# Altium project 边缘网关一体17KF4.PrjPcb
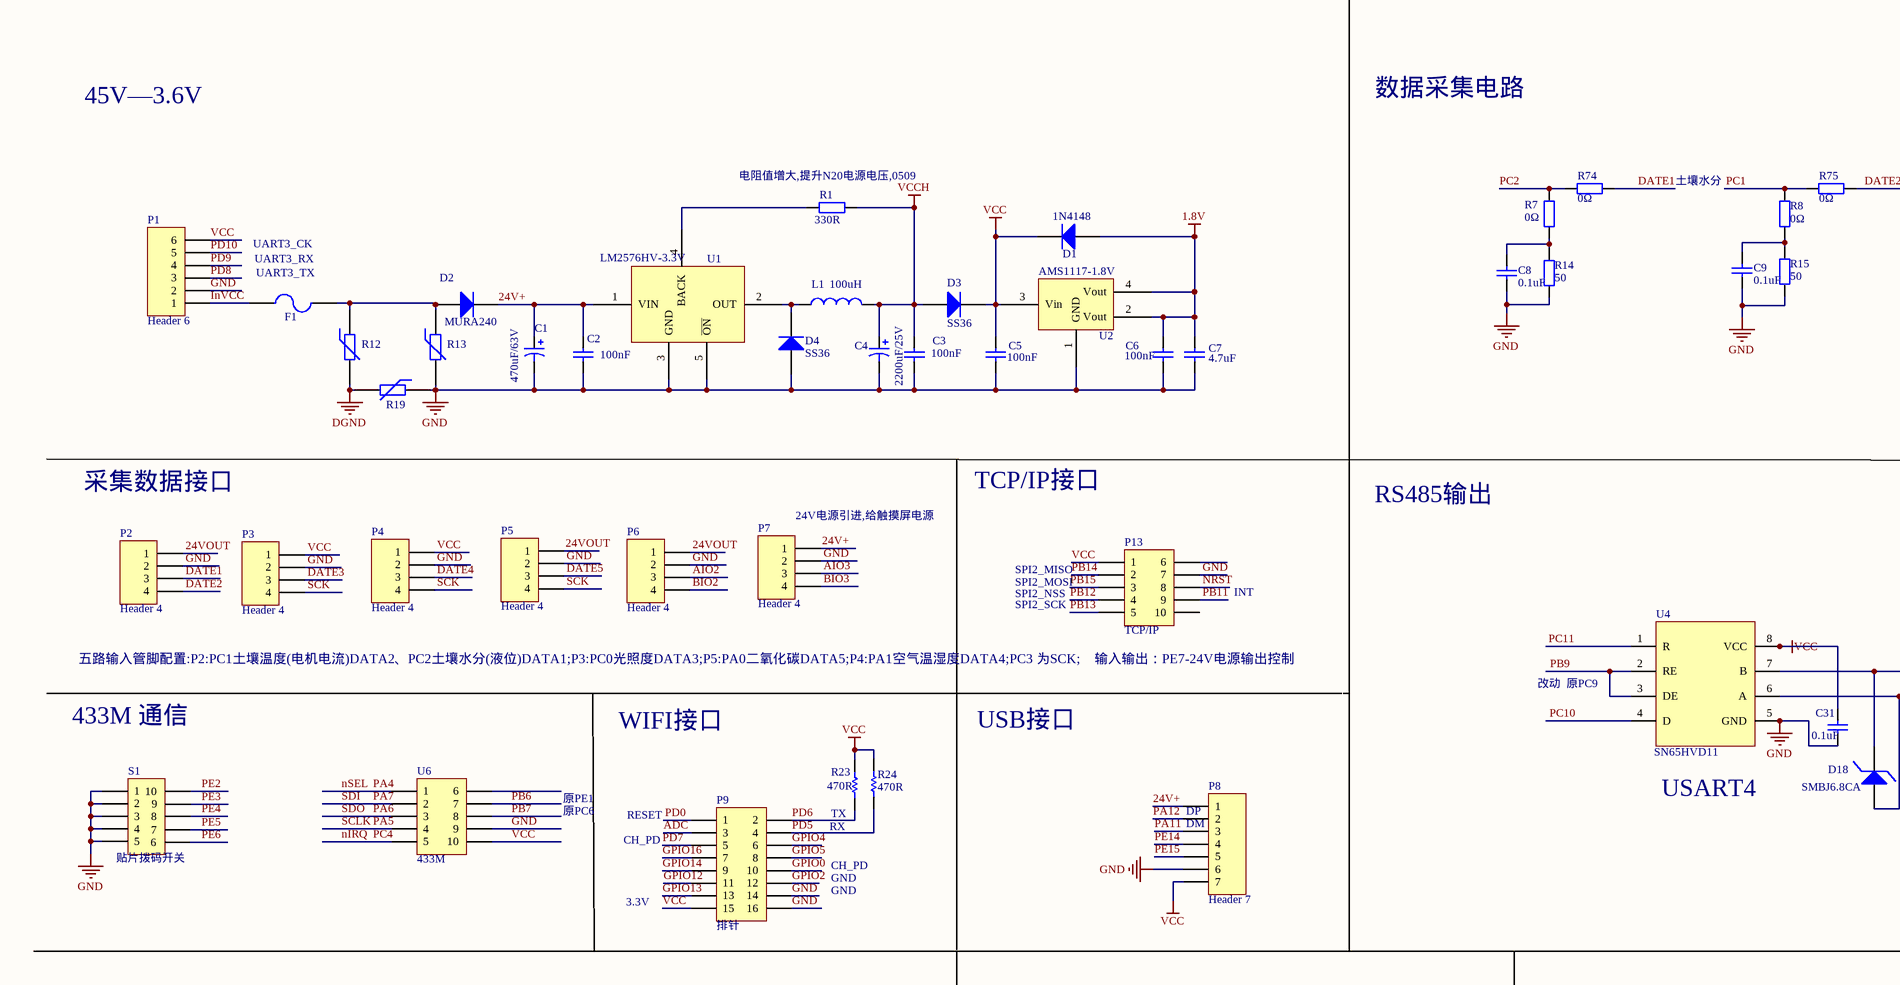
[diagram p0: 边缘网关一体.SchDoc, top left]
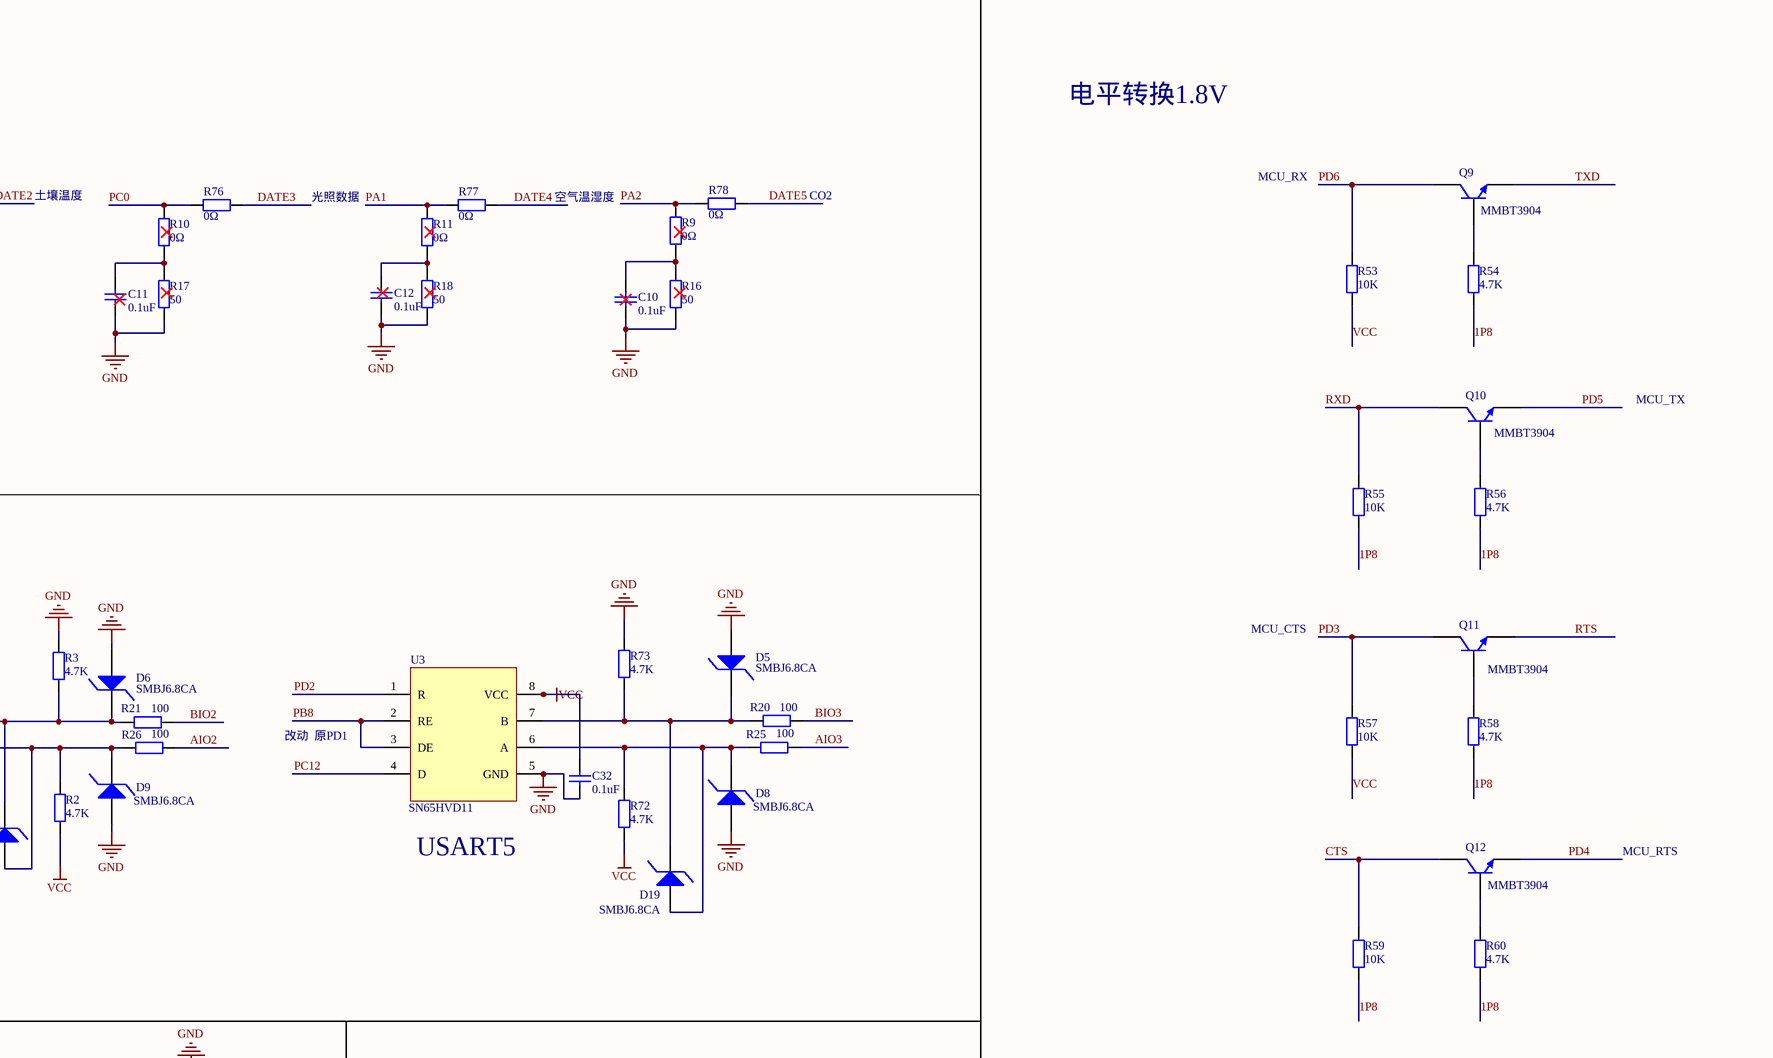
[diagram p1: 边缘网关一体.SchDoc, top right]
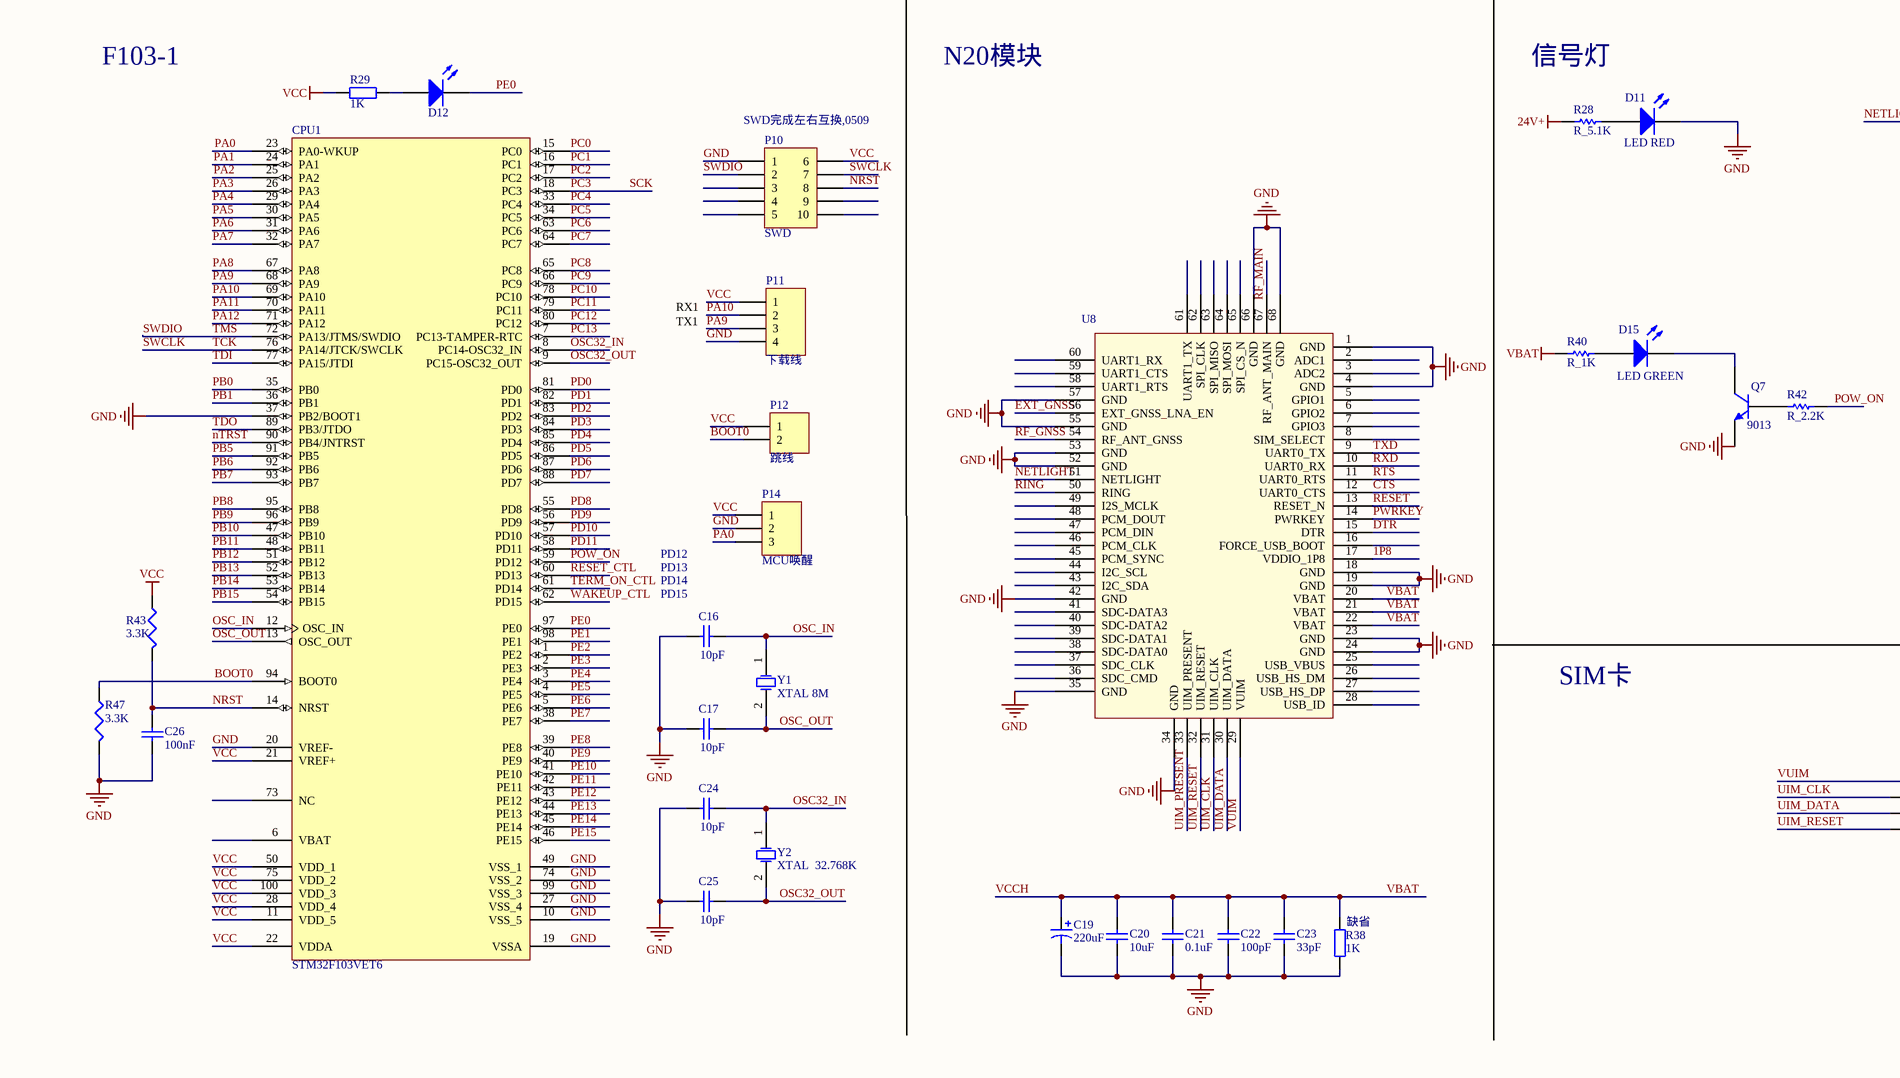
[diagram p2: 边缘网关一体.SchDoc, bottom left]
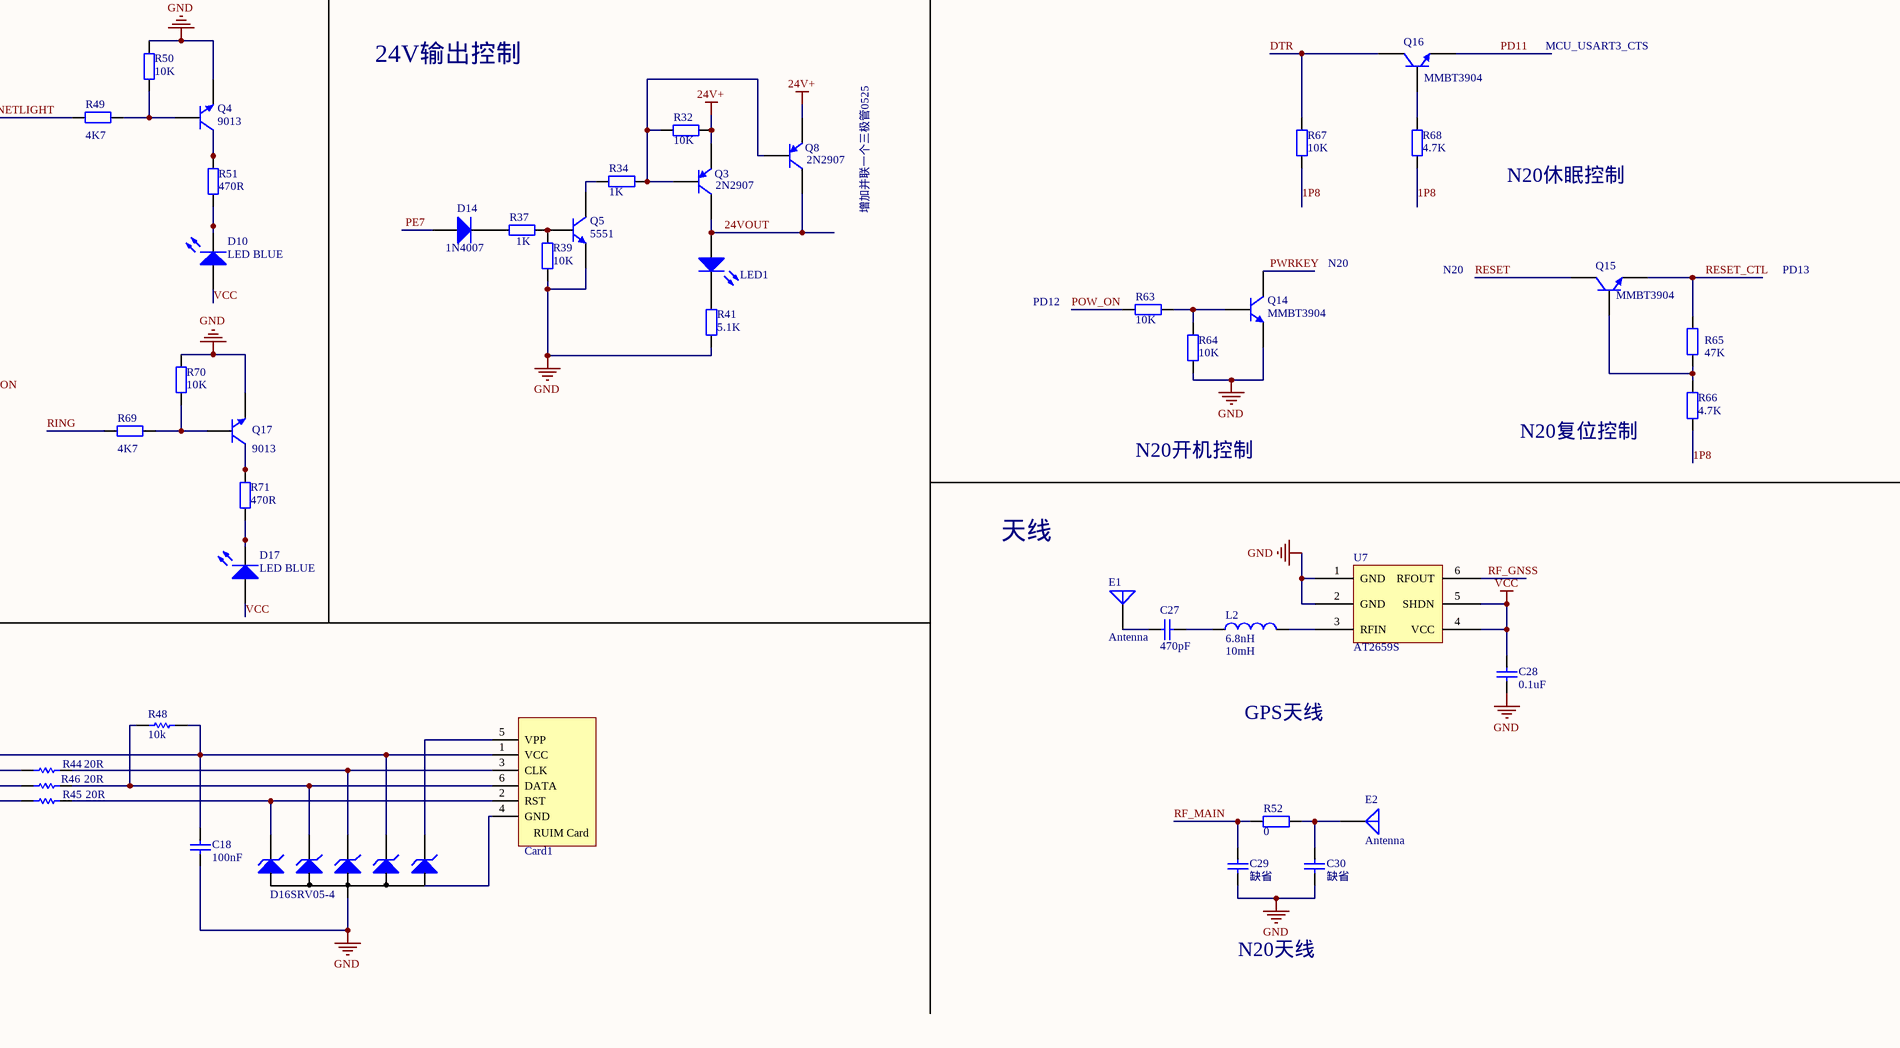
[diagram p3: 边缘网关一体.SchDoc, bottom right]
1 sheet, 157 parts. Net scope: global (net labels, ports and power ports of the same name join across sheets).
Board file: N20网关A.PcbDoc

## Sheet 边缘网关一体.SchDoc
size 762 x 406 mm

### Parts
C1  value 470uF/63V  [C470UF50V-H]  (hidden comment: C_470uF/63V)
C2  value 100nF  [0805]  (hidden comment: C_0.1uF)
C3  value 100nF  [0603]  (hidden comment: C_0.1uF)
C4  2200uF/25V  [C470UF50V-H]
C5  100nF  [0805]
C6  100nF  [0603]
C7  4.7uF  [0805]
C8  value 0.1uF  [0603]  (hidden comment: C_0.1uF)
C9  value 0.1uF  [0603]  (hidden comment: C_0.1uF)
C10  value 0.1uF  [0603]  (hidden comment: C_0.1uF)
C11  value 0.1uF  [0603]  (hidden comment: C_0.1uF)
C12  value 0.1uF  [0603]  (hidden comment: C_0.1uF)
C16  value 10pF  [0603]  (hidden comment: C_10pF)
C17  value 10pF  [0603]  (hidden comment: C_10pF)
C18  value 100nF  [0805]  (hidden comment: C_0.1uF)
C19  220uF  [1206]
C20  value 10uF  [0603]  (hidden comment: C_0.1uF)
C21  value 0.1uF  [0603]  (hidden comment: C_0.1uF)
C22  value 100pF  [0603]  (hidden comment: C_0.1uF)
C23  value 33pF  [0603]  (hidden comment: C_0.1uF)
C24  value 10pF  [0603]  (hidden comment: C_10pF)
C25  value 10pF  [0603]  (hidden comment: C_10pF)
C26  value 100nF  [0603]  (hidden comment: C_100nF)
C27  470pF  [1608[0603]]
C28  0.1uF  [1608[0603]]
C29  缺省  [0603]
C30  缺省  [0603]
C31  0.1uF  [0603]
C32  0.1uF  [0603]
Card1  Card  [SIM]  (value not drawn)
CPU1  STM32F103VET6  [LQFP100_N]
D1  1N4148  [1206]
D2  MURA240  [1N4007-M7]
D3  SS36  [1N4007-M7]
D4  SS36  [1N4007-M7]
D5  SMBJ6.8CA  [DO-214AB]
D6  SMBJ6.8CA  [DO-214AB]
D8  SMBJ6.8CA  [DO-214AB]
D9  SMBJ6.8CA  [DO-214AB]
D10  LED BLUE  [LED-3mm]
D11  LED RED  [LED-3mm]
D12  Green  [0603]  (value not drawn)
D14  1N4007  [1N4007-M7]
D15  LED GREEN  [LED-3mm]
D16  SRV05-4  [SOT23-6]
D17  LED BLUE  [LED-3mm]
D18  SMBJ6.8CA  [DO-214AB]
D19  SMBJ6.8CA  [DO-214AB]
E1  Antenna  [IPX]
E2  Antenna  [IPX]
F1  自恢复保险丝  [1812]  (value not drawn)
L1  value 100uH  [L101]  (hidden comment: 贴片电感)
L2  6.8nH  value 10mH  [L0603]
LED1  LED 3mm  [0603]  (value not drawn)
P1  Header 6  [PCBComponent_1]
P2  Header 4  [HDR1X4]
P3  Header 4  [HDR1X4]
P4  Header 4  [HDR1X4]
P5  Header 4  [HDR1X4]
P6  Header 4  [HDR1X4]
P7  Header 4  [HDR1X4]
P8  Header 7  [USB2]
P9  排针  [WIFI2]
P10  SWD  [HDR2X5_CEN]
P11  下载线  [HDR1X4]
P12  跳线  [HDR1X2]
P13  TCP/IP  [TCP-IP]
P14  MCU唤醒  [HDR1X3]
Q3  2N2907  [Q]
Q4  9013  [SOT-23]
Q5  5551  [Q]
Q7  9013  [SOT-23]
Q8  2N2907  [Q]
Q9  MMBT3904  [SOT23_N]
Q10  MMBT3904  [SOT23_N]
Q11  MMBT3904  [SOT23_N]
Q12  MMBT3904  [SOT23_N]
Q14  MMBT3904  [SOT23_N]
Q15  MMBT3904  [SOT23_N]
Q16  MMBT3904  [SOT23_N]
Q17  9013  [SOT-23]
R1  330R  [0805]
R2  4.7K  [0603]
R3  value 4.7K  [0603]  (hidden comment: 100R)
R7  value 0Ω  [0805]  (hidden comment: 50R)
R8  value 0Ω  [0805]  (hidden comment: 50R)
R9  value 0Ω  [0805]  (hidden comment: 50R)
R10  value 0Ω  [0805]  (hidden comment: 50R)
R11  value 0Ω  [0805]  (hidden comment: 50R)
R12  压敏电阻  [0805]  (value not drawn)
R13  压敏电阻  [0805]  (value not drawn)
R14  value 50  [0805]  (hidden comment: 50R)
R15  value 50  [0805]  (hidden comment: 50R)
R16  value 50  [0805]  (hidden comment: 50R)
R17  value 50  [0805]  (hidden comment: 50R)
R18  value 50  [0805]  (hidden comment: 50R)
R19  压敏电阻  [0805]  (value not drawn)
R20  value 100  [0603]  (hidden comment: 100R)
R21  value 100  [0603]  (hidden comment: 100R)
R23  470R  [0603]
R24  470R  [0603]
R25  value 100  [0603]  (hidden comment: 100R)
R26  value 100  [0603]  (hidden comment: 100R)
R28  R_5.1K  [0603]
R29  value 1K  [0603]  (hidden comment: R_1K)
R32  value 10K  [0603]  (hidden comment: R_10K)
R34  value 1K  [0603]  (hidden comment: R_1K)
R37  value 1K  [0603]  (hidden comment: R_1K)
R38  缺省  value 1K  [0603]
R39  value 10K  [0603]  (hidden comment: R_10K)
R40  R_1K  [0603]
R41  value 5.1K  [0603]  (hidden comment: R_5.1K)
R42  R_2.2K  [0603]
R43  value 3.3K  [0603]  (hidden comment: R_3.3K)
R44  20R  [0603]
R45  20R  [0603]
R46  20R  [0603]
R47  value 3.3K  [0603]  (hidden comment: R_3.3K)
R48  value 10k  [0603]  (hidden comment: 470R)
R49  value 4K7  [0603]  (hidden comment: Res2)
R50  value 10K  [0603]  (hidden comment: Res2)
R51  value 470R  [0603]  (hidden comment: Res2)
R52  0  [0603]
R53  10K  [0603]
R54  4.7K  [0603]
R55  10K  [0603]
R56  4.7K  [0603]
R57  10K  [0603]
R58  4.7K  [0603]
R59  10K  [0603]
R60  4.7K  [0603]
R63  10K  [0603]
R64  10K  [0603]
R65  47K  [0603]
R66  4.7K  [0603]
R67  10K  [0603]
R68  4.7K  [0603]
R69  value 4K7  [0603]  (hidden comment: Res2)
R70  value 10K  [0603]  (hidden comment: Res2)
R71  value 470R  [0603]  (hidden comment: Res2)
R72  4.7K  [0603]
R73  4.7K  [0603]
R74  value 0Ω  [0805]  (hidden comment: 50R)
R75  value 0Ω  [0805]  (hidden comment: 50R)
R76  value 0Ω  [0805]  (hidden comment: 50R)
R77  value 0Ω  [0805]  (hidden comment: 50R)
R78  value 0Ω  [0805]  (hidden comment: 50R)
S1  贴片拨码开关  [Switch10]
U1  LM2576HV-3.3V  [TO-263(S)]
U2  AMS1117-1.8V  [SOT223]
U3  SN65HVD11  [SN65HVD11]
U4  SN65HVD11  [SN65HVD11]
U6  433M  [433M]
U7  AT2659S  [SOT23-6]
U8  (no value)  [PCBComponent_1]
Y1  XTAL 8M  [XTAL 8M]
Y2  XTAL  32.768K  [R38]

### Nets
1.8V: C6.2 C7.1 D1.2 U2.2(Vout) U2.4(Vout)
24V+: C1.1 C2.2 D2.2(K) P7.1 P8.1 Q3.3(E) Q8.3(E) R28.1 R32.1 U1.1(VIN)
DGND: R12.2 R19.2
GND: C1.2 C2.1 C3.1 C4.2 C5.1 C6.1 C7.2 C8.2 C9.1 C10.1 C11.1 C12.1 C16.1 C17.1 C18.1 C19.2 C20.1 C21.1 C22.1 C23.1 C24.1 C25.1 C26.1 C28.1 C29.1 C30.1 C31.1 C32.1 CPU1.10(VSS_5) CPU1.19(VSSA) CPU1.20(VREF-) CPU1.27(VSS_4) CPU1.37(PB2/BOOT1) CPU1.49(VSS_1) CPU1.74(VSS_2) CPU1.99(VSS_3) D4.1(A) D5.1(A) D6.1(A) D8.1(A) D9.1(A) D11.2(K) D16.2 P1.2 P2.2 P3.2 P4.2 P5.2 P6.2 P7.2 P8.6 P9.14 P9.16 P10.1 P11.4 P13.7 P14.2 Q4.2(E) Q5.1(E) Q7.2(E) Q14.2(E) Q17.2(E) R3.2 R13.2 R14.1 R15.2 R16.2 R17.2 R18.2 R19.1 R38.1 R39.1 R41.2 R47.2 R50.2 R64.1 R70.2 R73.1 S1.1 S1.2 S1.3 S1.4 S1.5 U1.3(GND) U1.5(~{ON}) U2.1(GND) U3.5(GND) U4.5(GND) U6.9 U7.1(GND) U7.2(GND) U8.1(GND) U8.4(GND) U8.18(GND) U8.19(GND) U8.23(GND) U8.24(GND) U8.34(GND) U8.35(GND) U8.42(GND) U8.52(GND) U8.53(GND) U8.55(GND) U8.57(GND) U8.66(GND) U8.68(GND)
VBAT: C3.2 C4.1 C19.1 C20.2 C21.2 C22.2 C23.2 D3.1(A) L1.2 R1.1 R38.2 R40.1 U8.20(VBAT) U8.21(VBAT) U8.22(VBAT)  [also labelled VCCH]
VCC: C5.2 C28.2 C31.2 C32.2 CPU1.11(VDD_5) CPU1.21(VREF+) CPU1.22(VDDA) CPU1.28(VDD_4) CPU1.50(VDD_1) CPU1.75(VDD_2) CPU1.100(VDD_3) D1.1 D3.2(K) D10.1(A) D17.1(A) P1.6 P3.1 P4.1 P8.7 P9.15 P10.6 P11.1 P12.1 P13.1 P14.1 R2.2 R23.1 R24.1 R29.2 R43.1 R53.1 R57.1 R72.2 U2.3(Vin) U3.8(VCC) U4.8(VCC) U6.10 U7.4(VCC) U7.5(SHDN)
1P8: R54.1 R55.1 R56.1 R58.1 R59.1 R60.1 R66.1 R67.1 R68.1 U8.17(VDDIO_1P8)
24VOUT: LED1.1(A) P2.1 P5.1 P6.1 Q3.1(C) Q8.1(C)
ADC: P9.3
AIO2: P6.3 R26.2
AIO3: P7.3 R25.2
BIO2: P6.4 R21.2
BIO3: P7.4 R20.2
BOOT0: CPU1.94(BOOT0) P12.2 R47.1
CTS: Q12.3(C) R59.2 U8.12(UART0_CTS)
DATE1: P2.3 R74.1
DATE2: P2.4 R75.1
DATE3: P3.3 R76.1
DATE4: P4.3 R77.1
DATE5: P5.3 R78.1
DTR: Q16.3(C) R67.2 U8.15(DTR)
EXT_GNSS: U8.56(EXT_GNSS_LNA_EN)
GPIO0: P9.10
GPIO2: P9.12
GPIO4: P9.6
GPIO5: P9.8
GPIO12: P9.11
GPIO13: P9.13
GPIO14: P9.9
GPIO16: P9.7
InVCC: F1.2 P1.1
NETLIGHT: R49.1 U8.51(NETLIGHT)
nIRQ: CPU1.33(PC4) U6.5  [also labelled PC4]
NRST: C26.2 CPU1.14(NRST) P10.8 P13.8 R43.2
nSEL: CPU1.29(PA4) U6.1  [also labelled PA4]
nTRST: CPU1.90(PB4/JNTRST)
OSC32_IN: C24.2 CPU1.8(PC14-OSC32_IN) Y2.1(OSC1)
OSC32_OUT: C25.2 CPU1.9(PC15-OSC32_OUT) Y2.2(OSC2)
OSC_IN: C16.2 CPU1.12(OSC_IN) Y1.1(OSC1)
OSC_OUT: C17.2 CPU1.13(OSC_OUT) Y1.2(OSC2)
PA0: CPU1.23(PA0-WKUP) P14.3
PA1: CPU1.24(PA1) R11.2 R77.2
PA2: CPU1.25(PA2) R9.2 R78.2
PA3: CPU1.26(PA3)
PA5: CPU1.30(PA5) U6.4  [also labelled SCLK]
PA6: CPU1.31(PA6) U6.3  [also labelled SDO]
PA7: CPU1.32(PA7) U6.2  [also labelled SDI]
PA8: CPU1.67(PA8)
PA9: CPU1.68(PA9) P11.3
PA10: CPU1.69(PA10) P11.2
PA11: CPU1.70(PA11) P8.3
PA12: CPU1.71(PA12) P8.2
PB0: CPU1.35(PB0)
PB1: CPU1.36(PB1)
PB5: CPU1.91(PB5)
PB6: CPU1.92(PB6) U6.7
PB7: CPU1.93(PB7) U6.8
PB8: CPU1.95(PB8) U3.2(RE) U3.3(DE)
PB9: CPU1.96(PB9) U4.2(RE) U4.3(DE)
PB10: CPU1.47(PB10)
PB11: CPU1.48(PB11) P13.9
PB12: CPU1.51(PB12) P13.4
PB13: CPU1.52(PB13) P13.5
PB14: CPU1.53(PB14) P13.2
PB15: CPU1.54(PB15) P13.3
PC0: CPU1.15(PC0) R10.2 R76.2
PC1: CPU1.16(PC1) R8.2 R75.2
PC2: CPU1.17(PC2) R7.2 R74.2
PC3: CPU1.18(PC3) P3.4 P4.4 P5.4  [also labelled SCK]
PC5: CPU1.34(PC5)
PC6: CPU1.63(PC6)
PC7: CPU1.64(PC7)
PC8: CPU1.65(PC8)
PC9: CPU1.66(PC9)
PC10: CPU1.78(PC10) U4.4(D)
PC11: CPU1.79(PC11) U4.1(R)
PC12: CPU1.80(PC12) U3.4(D)
PC13: CPU1.7(PC13-TAMPER-RTC)
PD0: CPU1.81(PD0) P9.1
PD1: CPU1.82(PD1)
PD2: CPU1.83(PD2) U3.1(R)
PD3: CPU1.84(PD3) Q11.3(C) R57.2
PD4: CPU1.85(PD4) Q12.2(E)
PD5: CPU1.86(PD5) P9.4 Q10.2(E) R24.2
PD6: CPU1.87(PD6) P9.2 Q9.3(C) R23.2 R53.2
PD7: CPU1.88(PD7) P9.5
PD8: CPU1.55(PD8) P1.3
PD9: CPU1.56(PD9) P1.4
PD10: CPU1.57(PD10) P1.5
PD11: CPU1.58(PD11) Q16.2(E)
PE0: CPU1.97(PE0) D12.2(K)
PE1: CPU1.98(PE1)
PE2: CPU1.1(PE2) S1.10
PE3: CPU1.2(PE3) S1.9
PE4: CPU1.3(PE4) S1.8
PE5: CPU1.4(PE5) S1.7
PE6: CPU1.5(PE6) S1.6
PE7: CPU1.38(PE7) D14.1(A)
PE8: CPU1.39(PE8)
PE9: CPU1.40(PE9)
PE10: CPU1.41(PE10)
PE11: CPU1.42(PE11)
PE12: CPU1.43(PE12)
PE13: CPU1.44(PE13)
PE14: CPU1.45(PE14) P8.4
PE15: CPU1.46(PE15) P8.5
POW_ON: CPU1.59(PD12) R42.2 R63.2
PWRKEY: Q14.3(C) U8.14(PWRKEY)
RESET: Q15.3(C) U8.13(RESET_N)
RESET_CTL: CPU1.60(PD13) Q15.2(E) R65.2
RF_GNSS: U7.6(RFOUT) U8.54(RF_ANT_GNSS)
RF_MAIN: C29.2 R52.1
RING: R69.1 U8.50(RING)
RTS: Q11.2(E) U8.11(UART0_RTS)
RXD: Q10.3(C) R55.2 U8.10(UART0_RX)
SWCLK: CPU1.76(PA14/JTCK/SWCLK) P10.7  [also labelled TCK]
SWDIO: CPU1.72(PA13/JTMS/SWDIO) P10.2  [also labelled TMS]
TDI: CPU1.77(PA15/JTDI)
TDO: CPU1.89(PB3/JTDO)
TERM_ON_CTL: CPU1.61(PD14)
TXD: Q9.2(E) U8.9(UART0_TX)
UIM_CLK: R44.2 U8.31(UIM_CLK)
UIM_DATA: R46.2 U8.30(UIM_DATA)
UIM_PRESENT: U8.33(UIM_PRESENT)
UIM_RESET: R45.2 U8.32(UIM_RESET)
VUIM: C18.2 Card1.1(VCC) D16.3 R48.2 U8.29(VUIM)
WAKEUP_CTL: CPU1.62(PD15)
NetC8_1: C8.1 R7.1 R14.2
NetC9_2: C9.2 R8.1 R15.1
NetC10_2: C10.2 R9.1 R16.1
NetC11_2: C11.2 R10.1 R17.1
NetC12_2: C12.2 R11.1 R18.1
NetC27_1: C27.1 E1.1(A)
NetC27_2: C27.2 L2.1
NetC30_2: C30.2 E2.1(A) R52.2
NetCard1_2: Card1.2(RST) D16.4 R45.1
NetCard1_3: Card1.3(CLK) D16.5 R44.1
NetCard1_5: Card1.5(VPP) D16.1
NetCard1_6: Card1.6(DATA) D16.6 R46.1 R48.1
NetD2_1: D2.1(A) F1.1 R12.1 R13.1
NetD4_2: D4.2(K) L1.1 U1.2(OUT)
NetD5_2: D5.2(K) D19.2(K) R20.1 R73.2 U3.7(B)
NetD6_2: D6.2(K) D18.2(K) R3.1 R21.1 U4.7(B)
NetD8_2: D8.2(K) D19.1(A) R25.1 R72.1 U3.6(A)
NetD9_2: D9.2(K) D18.1(A) R2.1 R26.1 U4.6(A)
NetD10_2: D10.2(K) R51.2
NetD11_1: D11.1(A) R28.2
NetD12_1: D12.1(A) R29.1
NetD14_2: D14.2(K) R37.1
NetD15_1: D15.1(A) R40.2
NetD15_2: D15.2(K) Q7.3(C)
NetD17_2: D17.2(K) R71.2
NetL2_2: L2.2 U7.3(RFIN)
NetLED1_2: LED1.2(K) R41.1
NetQ3_2: Q3.2(B) Q8.2(B) R32.2 R34.1
NetQ4_1: Q4.1(B) R49.2 R50.1
NetQ4_3: Q4.3(C) R51.1
NetQ5_2: Q5.2(B) R37.2 R39.2
NetQ5_3: Q5.3(C) R34.2
NetQ7_1: Q7.1(B) R42.1
NetQ9_1: Q9.1(B) R54.2
NetQ10_1: Q10.1(B) R56.2
NetQ11_1: Q11.1(B) R58.2
NetQ12_1: Q12.1(B) R60.2
NetQ14_1: Q14.1(B) R63.1 R64.2
NetQ15_1: Q15.1(B) R65.1 R66.2
NetQ16_1: Q16.1(B) R68.2
NetQ17_1: Q17.1(B) R69.2 R70.1
NetQ17_3: Q17.3(C) R71.1
NetR1_2: R1.2 U1.4(BACK)

Not connected (* = marked no-connect by the designer): Card1 4(GND); CPU1 6(VBAT) 73(NC); P10 3 4 5 9 10; P13 6 10; U6 6; U8 2(ADC1) 3(ADC2) 5(GPIO1) 6(GPIO2) 7(GPIO3) 8(SIM_SELECT) 16(FORCE_USB_BOOT) 25(USB_VBUS) 26(USB_HS_DM) 27(USB_HS_DP) 28(USB_ID) 36(SDC_CMD) 37(SDC_CLK) 38(SDC-DATA0) 39(SDC-DATA1) 40(SDC-DATA2) 41(SDC-DATA3) 43(I2C_SDA) 44(I2C_SCL) 45(PCM_SYNC) 46(PCM_CLK) 47(PCM_DIN) 48(PCM_DOUT) 49(I2S_MCLK) 58(UART1_RTS) 59(UART1_CTS) 60(UART1_RX) 61(UART1_TX) 62(SPI_CLK) 63(SPI_MISO) 64(SPI_MOSI) 65(SPI_CS_N) 67(RF_ANT_MAIN)

### Notes on the sheet
- 45V—3.6V
- 数据采集电路
- 电平转换1.8V
- MCU_RX
- (near R1) 电阻值增大,提升N20电源电压,0509
- 土壤水分
- 土壤温度
- 光照数据
- 空气温湿度
- CO2
- UART3_CK
- (near F1) UART3_RX
- (near F1) UART3_TX
- MCU_TX
- 采集数据接口
- TCP/IP接口
- (near P7) 24V电源引进,给触摸屏电源
- RS485输出
- SPI2_MISO
- SPI2_MOSI
- SPI2_SCK
- SPI2_NSS
- INT
- MCU_CTS
- 五路输入管脚配置:P2:PC1土壤温度(电机电流)DATA2、PC2土壤水分(液位)DATA1;P3:PC0光照度DATA3;P5:PA0二氧化碳DATA5;P4:PA1空气温湿度DATA4;PC3 为SCK;    输入输出：PE7-24V电源输出控制
- 433M 通信
- WIFI接口
- USB接口
- 改动  原PC9
- 改动  原PD1
- 原PE1
- USART4
- USART5
- MCU_RTS
- 原PC6
- CH_PD
- RESET
- RX
- (near R23) TX
- (near P8) DM
- (near P8) DP
- 3.3V
- GND
- F103-1
- N20模块
- (near R28) 信号灯
- 24V输出控制
- MCU_USART3_CTS
- (near P10) SWD完成左右互换,0509
- 增加并联一个三极管0525
- N20休眠控制
- N20
- PD13
- PD12
- N20开机控制
- N20复位控制
- 天线
- (near C16) PD14
- (near C16) PD15
- SIM卡
- GPS天线
- N20天线
- Labels drawn without touching a wire or pin: RF_MAIN, RX1, TX1
- (in symbol Card) RUIM Card

### Library data of the parts
C1 = Cap Pol1: 插件 电解电容 13*21; Published: 8-Jun-2000; LatestRevisionDate: 17-Jul-2002; LatestRevisionNote: Re-released for DXP Platform.; PackageReference: RB7.6-15; Publisher: Altium Limited
C2 C3 C5-C12 C16-C18 C20-C26 = Cap: 贴片电容 0603
  C2 C3 C8-C12 C16-C18 C20-C26: Published: 8-Jun-2000; LatestRevisionDate: 17-Jul-2002; LatestRevisionNote: Re-released for DXP Platform.; PackageReference: RAD-0.3; Publisher: Altium Limited
  C5 C6: Published: 8-Jun-2000; LatestRevisionDate: 17-Jul-2002; LatestRevisionNote: Re-released for DXP Platform.; PackageReference: RAD-0.3; Publisher: Altium Limited; Value: 100nF
C4 = Cap Pol1: 插件 体积13*20mm; Value: 470uF/25V; Published: 8-Jun-2000; LatestRevisionDate: 17-Jul-2002; LatestRevisionNote: Re-released for DXP Platform.; PackageReference: RB7.6-15; Publisher: Altium Limited
C19 = Cap Pol1: Polarized Capacitor (Radial); Value: 4.7uF; Published: 8-Jun-2000; LatestRevisionDate: 17-Jul-2002; LatestRevisionNote: Re-released for DXP Platform.; PackageReference: RB7.6-15; Publisher: Altium Limited
C27 = Cap: Capacitor; Published: 8-Jun-2000; LatestRevisionDate: 17-Jul-2002; LatestRevisionNote: Re-released for DXP Platform.; PackageReference: RAD-0.3; Publisher: Altium Limited; Value: 470pF
C28 = Cap: Capacitor; Value: 100pF; Published: 8-Jun-2000; LatestRevisionDate: 17-Jul-2002; LatestRevisionNote: Re-released for DXP Platform.; PackageReference: RAD-0.3; Publisher: Altium Limited
C29-C32 = Cap: Capacitor; Value: 0.01uF; Published: 8-Jun-2000; LatestRevisionDate: 17-Jul-2002; LatestRevisionNote: Re-released for DXP Platform.; PackageReference: RAD-0.3; Publisher: Altium Limited
CPU1 = STM32F103VBT6: 贴片ARM芯片; Published: 30-May-2008; DatasheetVersion: rev6, Mar-2008; PackageVersion: Mar-2008; PackageReference: LQFP100; Publisher: Altium Limited; PackageDescription: 100-Pin Low-Profile Quad Flat Pack, 14 x 14 mm Body, 0.5 mm Pitch (LQFP100); ComponentLink1Description: Manufacturer Link; ComponentLink1URL: www.st.com/stm32; ComponentLink2Description: Datasheet; ComponentLink2URL: http://www.st.com/stonline/products/literature/ds/13587.pdf
D1 D2 = Diode: 贴片二极管 M7; Published: 8-Jun-2000; LatestRevisionDate: 17-Jul-2002; LatestRevisionNote: Re-released for DXP Platform.; PackageDocument: Sep-1996; PackageReference: SMC; Publisher: Altium Limited; Code_JEDEC: DO-214-AB
D3 D4 = Diode 1N4007: 贴片二极管 SMA; Published: 8-Jun-2000; LatestRevisionDate: 17-Jul-2002; LatestRevisionNote: Re-released for DXP Platform.; DatasheetDocument: 1998; PackageDocument: Aug-1999; PackageReference: DO-41; Publisher: Altium Limited; Code_JEDEC: DO-204-AL; ComponentLink1Description: Manufacturer Link; ComponentLink1URL: http://www.fairchildsemi.com/; ComponentLink2Description: Datasheet; ComponentLink2URL: http://www.fairchildsemi.com/ds/1N%2F1N4001.pdf
D5 D6 D8 D9 D18 D19 = SMBJ6.8CA: 贴片双向瞬变抑制二极管 D0-214AA
D10 D11 D17 = LED0: 插件 发光二极管 5mm 红发红光; Published: 8-Jun-2000; LatestRevisionDate: 08-Jul-2005; LatestRevisionNote: Mech Layer 1 removed.; PackageReference: LED-0; Publisher: Altium Limited
D12 = LED 3mm: 贴片发光二极管 0603 绿色
D14 = Diode 1N4007: 1 Amp General Purpose Rectifier; Published: 8-Jun-2000; LatestRevisionDate: 17-Jul-2002; LatestRevisionNote: Re-released for DXP Platform.; DatasheetDocument: 1998; PackageDocument: Aug-1999; PackageReference: DO-41; Publisher: Altium Limited; Code_JEDEC: DO-204-AL; ComponentLink1Description: Manufacturer Link; ComponentLink1URL: http://www.fairchildsemi.com/; ComponentLink2Description: Datasheet; ComponentLink2URL: http://www.fairchildsemi.com/ds/1N%2F1N4001.pdf
D15 = LED0: 插件 发光二极管 5mm 绿发绿光; Published: 8-Jun-2000; LatestRevisionDate: 08-Jul-2005; LatestRevisionNote: Mech Layer 1 removed.; PackageReference: LED-0; Publisher: Altium Limited
D16 = SMF05C: SOT363; Publisher: Altium Limited
E1 E2 = Antenna: Generic Antenna; Published: 24-Mar-1999; LatestRevisionDate: 17-Jul-2002; LatestRevisionNote: Re-released for DXP Platform.; PackageReference: PIN1; Publisher: Altium Limited
F1 = Fuse 2: 1812 1.1A 33V; Published: 8-Jun-2000; LatestRevisionDate: 17-Jul-2002; LatestRevisionNote: Re-released for DXP Platform.; PackageReference: PIN-W2/E2.8; Publisher: Altium Limited
L1 = Inductor: 贴片电感 12*12*7mm 100uH; Code_IEC: 1005; Published: 8-Jun-2000; LatestRevisionDate: 17-Jul-2002; LatestRevisionNote: Re-released for DXP Platform.; PackageReference: 0402-A; Publisher: Altium Limited; Code_JEITA: 0402
L2 = Inductor: Code_IEC: 1005; Published: 8-Jun-2000; LatestRevisionDate: 17-Jul-2002; LatestRevisionNote: Re-released for DXP Platform.; PackageReference: 0402-A; Publisher: Altium Limited; Code_JEITA: 0402
LED1 = LED 3mm: LED_R
P1 = Header 6: Header, 6-Pin; LatestRevisionDate: 17-Jul-2002; LatestRevisionNote: Re-released for DXP Platform.; Publisher: Altium Limited
P2-P7 P11 = Header 4: Header, 4-Pin; LatestRevisionDate: 17-Jul-2002; LatestRevisionNote: Re-released for DXP Platform.; Publisher: Altium Limited
P8 = Header 7: Header, 7-Pin; LatestRevisionDate: 17-Jul-2002; LatestRevisionNote: Re-released for DXP Platform.; Publisher: Altium Limited
P9 = Header 8X2: 插件 8P 间距2mm; LatestRevisionDate: 17-Jul-2002; LatestRevisionNote: Re-released for DXP Platform.; Publisher: Altium Limited
P10 P13 U6 = Header 5X2A: Header, 5-Pin, Dual row; LatestRevisionDate: 17-Jul-2002; LatestRevisionNote: Re-released for DXP Platform.; Publisher: Altium Limited
P12 = Header 2: Header, 2-Pin; LatestRevisionDate: 17-Jul-2002; LatestRevisionNote: Re-released for DXP Platform.; Publisher: Altium Limited
P14 = Header 3: Header, 3-Pin; LatestRevisionDate: 17-Jul-2002; LatestRevisionNote: Re-released for DXP Platform.; Publisher: Altium Limited
Q3 Q8 = PNP: PNP Bipolar Transistor; Published: 8-Jun-2000; LatestRevisionDate: 17-Jul-2002; LatestRevisionNote: Re-released for DXP Platform.; PackageReference: SOT-23B; Publisher: Altium Limited; Code_JEDEC: SOT-23
Q4 Q7 Q17 = NPN: 贴片三极管MMBT5551 SOT-23; Published: 8-Jun-2000; LatestRevisionDate: 17-Jul-2002; LatestRevisionNote: Re-released for DXP Platform.; PackageReference: TO-226; Publisher: Altium Limited; Code_JEDEC: TO-226-AA
Q5 = 2N3904: Published: 8-Jun-2000; LatestRevisionDate: 15-Jan-2003; LatestRevisionNote: PCB Footprint 'BCY-W3/D4.7' replaced; DatasheetDocument: 1997; PackageDocument: Sep-1998; PackageReference: TO-92A; Publisher: Altium Limited; Code_JEDEC: TO-92A; ComponentLink1Description: Manufacturer Link; ComponentLink1URL: http://www.fairchildsemi.com/; ComponentLink2Description: Datasheet; ComponentLink2URL: http://www.fairchildsemi.com/ds/2N%2F2N3904.pdf
Q9-Q12 Q14-Q16 = MMBT3904: NPN Switching Transistor; Published: 17-Sep-2003; LatestRevisionDate: 12-Dec-2006; LatestRevisionNote: IPC-7351 Footprint Added.; DatasheetVersion: 13-May-2002; PackageVersion: May-1999; PackageReference: SOT23; Publisher: Altium Limited; PackageDescription: 3-Pin SOT-23 Package 0.95 mm Pitch, 2.3 mm Lead Span; ComponentLink1Description: Manufacturer Link; ComponentLink1URL: http://www.semiconductors.philips.com/; ComponentLink2Description: Datasheet; ComponentLink2URL: http://www.semiconductors.philips.com/acrobat/datasheets/MMBT3904_4.pdf
R1 = Res2: 贴片电阻 0805 精度0.1%; Value: 100Ω; Published: 8-Jun-2000; LatestRevisionDate: 17-Jul-2002; LatestRevisionNote: Re-released for DXP Platform.; PackageReference: AXIAL-0.4; Publisher: Altium Limited
R2 R3 R20 R21 R25 R26 R29 R72 R73 = Res2: 贴片电阻 0603; Published: 8-Jun-2000; LatestRevisionDate: 17-Jul-2002; LatestRevisionNote: Re-released for DXP Platform.; PackageReference: AXIAL-0.4; Publisher: Altium Limited
  R2 R72 R73: Value: 4.7K
R7-R11 R14-R18 R74-R78 = Res2: 贴片电阻 0805 精度0.1%; Published: 8-Jun-2000; LatestRevisionDate: 17-Jul-2002; LatestRevisionNote: Re-released for DXP Platform.; PackageReference: AXIAL-0.4; Publisher: Altium Limited
R12 R13 R19 = Res Varistor: 耐压56V 0805; Published: 24-Mar-1999; LatestRevisionDate: 04-Mar-2005; LatestRevisionNote: PCB Footprint replaced.; PackageReference: 6-0805; Publisher: Altium Limited
R23 R24 R48 = Res1: 贴片电阻 0603; Published: 8-Jun-2000; LatestRevisionDate: 17-Jul-2002; LatestRevisionNote: Re-released for DXP Platform.; PackageReference: AXIAL-0.3; Publisher: Altium Limited
  R23 R24: Value: 470R
R28 R44-R46 = Resistor: 贴片电阻 0603
R32 R34 R37-R39 R49-R52 R69-R71 = Res2: Resistor; Published: 8-Jun-2000; LatestRevisionDate: 17-Jul-2002; LatestRevisionNote: Re-released for DXP Platform.; PackageReference: AXIAL-0.4; Publisher: Altium Limited
  R52: Value: 0
R40 R42 = Resistor
R41 = Res2: R_10K; Published: 8-Jun-2000; LatestRevisionDate: 17-Jul-2002; LatestRevisionNote: Re-released for DXP Platform.; PackageReference: AXIAL-0.4; Publisher: Altium Limited
R43 R47 = Res3: 贴片电阻 0603; Published: 8-Jun-2000; LatestRevisionDate: 04-Mar-2005; LatestRevisionNote: PCB Footprint replaced.; PackageReference: J1-0603; Publisher: Altium Limited
R53-R60 R63-R68 = Res2: Resistor; Value: 0; Published: 8-Jun-2000; LatestRevisionDate: 17-Jul-2002; LatestRevisionNote: Re-released for DXP Platform.; PackageReference: AXIAL-0.4; Publisher: Altium Limited
S1 = Switch: 5P 2.54MM  黑色
U1 = Component_1: 贴片电源芯片 TO-263
U2 = AS1117: VOLTAGE REGULATOR
U3 U4 = SN65HVD11: 贴片芯片
U7 U8 = Component_1
Y1 = XTAL 8M: 晶振
Y2 = XTAL: 晶振; Published: 8-Jun-2000; LatestRevisionDate: 17-Jul-2002; LatestRevisionNote: Re-released for DXP Platform.; PackageReference: R38; Publisher: Altium Limited